# EAGLE design NSL_ESC (EAGLE 5.11)

## Sheet 1 of 3
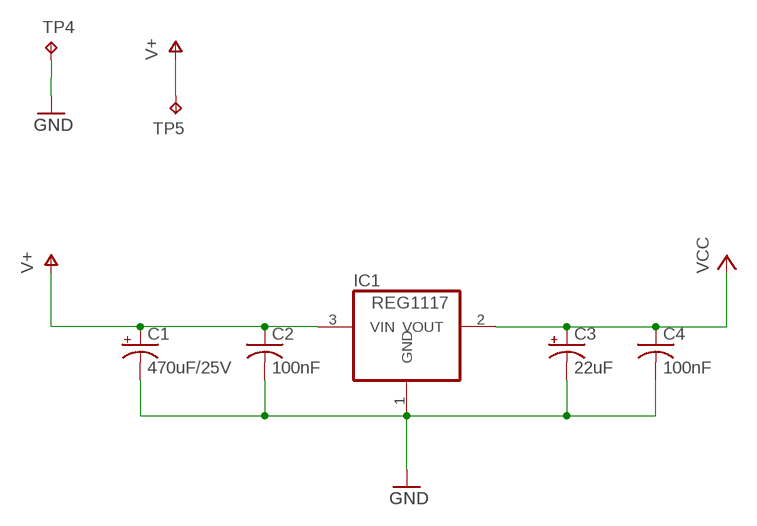
[diagram p0: schematic, sheet 1]

### Parts
C1  470uF/25V  CPOL-USE2-5  [E2-5]
C2  100nF  C-USC0805  [C0805]
C3  22uF  CPOL-USC/6032-28R  [C/6032-28R]
C4  100nF  C-USC0805  [C0805]
IC1  REG1117  [SOT223]
TP4  TPPAD1-20Y  [P1-20Y]
TP5  TPPAD1-20Y  [P1-20Y]

### Nets
GND: C1.- C2.2 C3.- C4.2 IC1.1(GND) TP4.TP ; also sheet 2,3
V+: C1.+ C2.1 IC1.3(VIN) TP5.TP ; also sheet 3
VCC: C3.+ C4.1 IC1.2(VOUT) ; also sheet 2

## Sheet 2 of 3
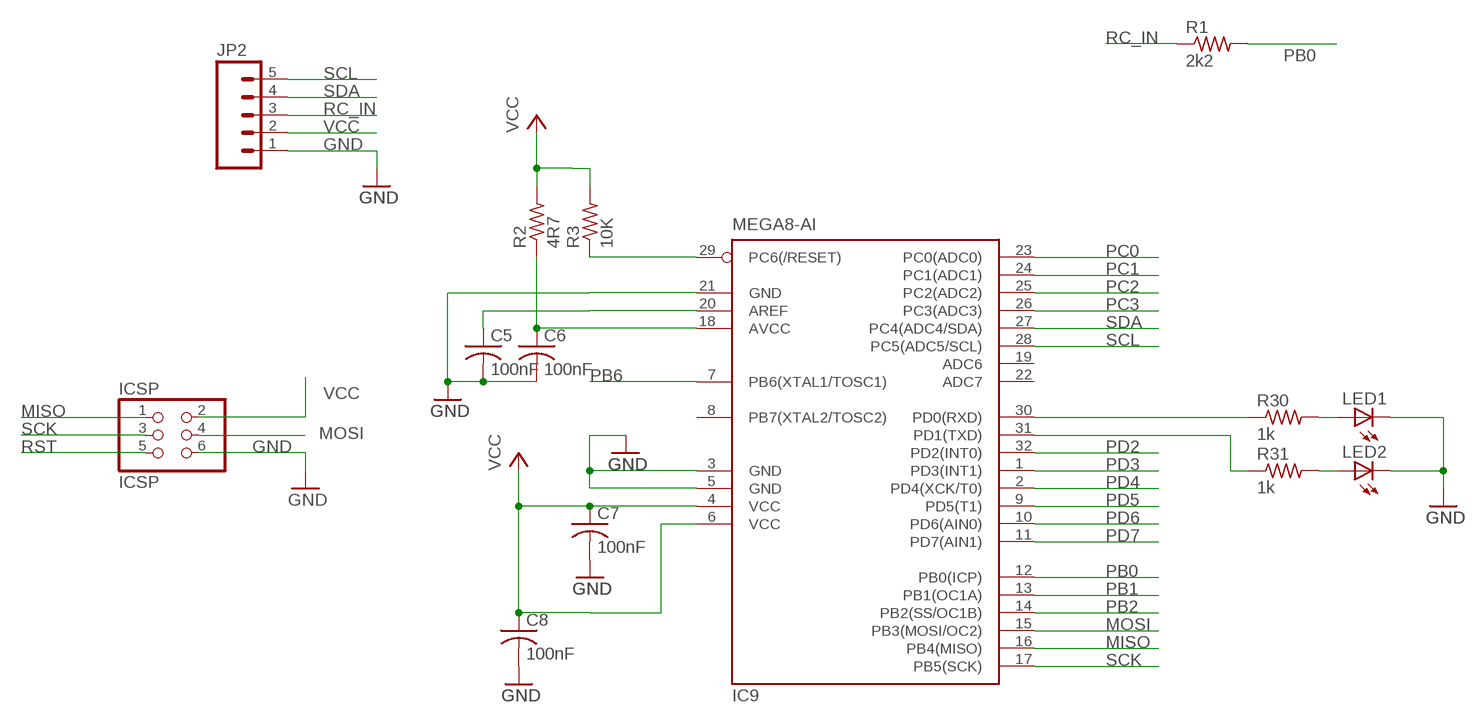
[diagram p1: schematic, sheet 2]

### Parts
C5  100nF  C-USC0805  [C0805]
C6  100nF  C-USC0805  [C0805]
C7  100nF  C-USC0805  [C0805]
C8  100nF  C-USC0805  [C0805]
IC9  MEGA8-AI  [TQFP32-08]
ICSP  ICSP  PINHD-2X3  [2X03]
JP2  M05PTH  [1X05]
LED1  LEDCHIP-LED0603  [CHIP-LED0603]
LED2  LEDCHIP-LED0603  [CHIP-LED0603]
R1  2k2  R-US_R0805  [R0805]
R2  4R7  R-US_R0805  [R0805]
R3  10K  R-US_R0805  [R0805]
R30  1k  R-US_R0805  [R0805]
R31  1k  R-US_R0805  [R0805]

### Nets
GND: C5.2 C6.2 C7.2 C8.2 IC9.3(GND) IC9.5(GND) IC9.21(GND) ICSP.6 JP2.1 LED1.C LED2.C ; also sheet 1,3
MISO: IC9.16(PB4(MISO)) ICSP.1
MOSI: IC9.15(PB3(MOSI/OC2)) ICSP.4
N$9: IC9.29(PC6(/RESET)) R3.1
N$13: IC9.30(PD0(RXD)) R30.1
N$17: C5.1 IC9.20(AREF)
N$19: C6.1 IC9.18(AVCC) R2.1
N$22: IC9.31(PD1(TXD)) R31.1
N$23: LED1.A R30.2
N$25: LED2.A R31.2
PB0: IC9.12(PB0(ICP)) R1.2
PB1: IC9.13(PB1(OC1A)) ; also sheet 3
PB2: IC9.14(PB2(SS/OC1B)) ; also sheet 3
PB6: IC9.7(PB6(XTAL1/TOSC1)) ; also sheet 3
PC0: IC9.23(PC0(ADC0)) ; also sheet 3
PC1: IC9.24(PC1(ADC1)) ; also sheet 3
PC2: IC9.25(PC2(ADC2)) ; also sheet 3
PC3: IC9.26(PC3(ADC3)) ; also sheet 3
PD2: IC9.32(PD2(INT0))
PD3: IC9.1(PD3(INT1)) ; also sheet 3
PD4: IC9.2(PD4(XCK/T0)) ; also sheet 3
PD5: IC9.9(PD5(T1)) ; also sheet 3
PD6: IC9.10(PD6(AIN0)) ; also sheet 3
PD7: IC9.11(PD7(AIN1))
RC_IN: JP2.3 R1.1
RST: ICSP.5
SCK: IC9.17(PB5(SCK)) ICSP.3
SCL: IC9.28(PC5(ADC5/SCL)) JP2.5
SDA: IC9.27(PC4(ADC4/SDA)) JP2.4
VCC: C7.1 C8.1 IC9.4(VCC) IC9.6(VCC) ICSP.2 JP2.2 R2.2 R3.2 ; also sheet 1
Unconnected: IC9.8(PB7(XTAL2/TOSC2)) IC9.19(ADC6) IC9.22(ADC7)

## Sheet 3 of 3
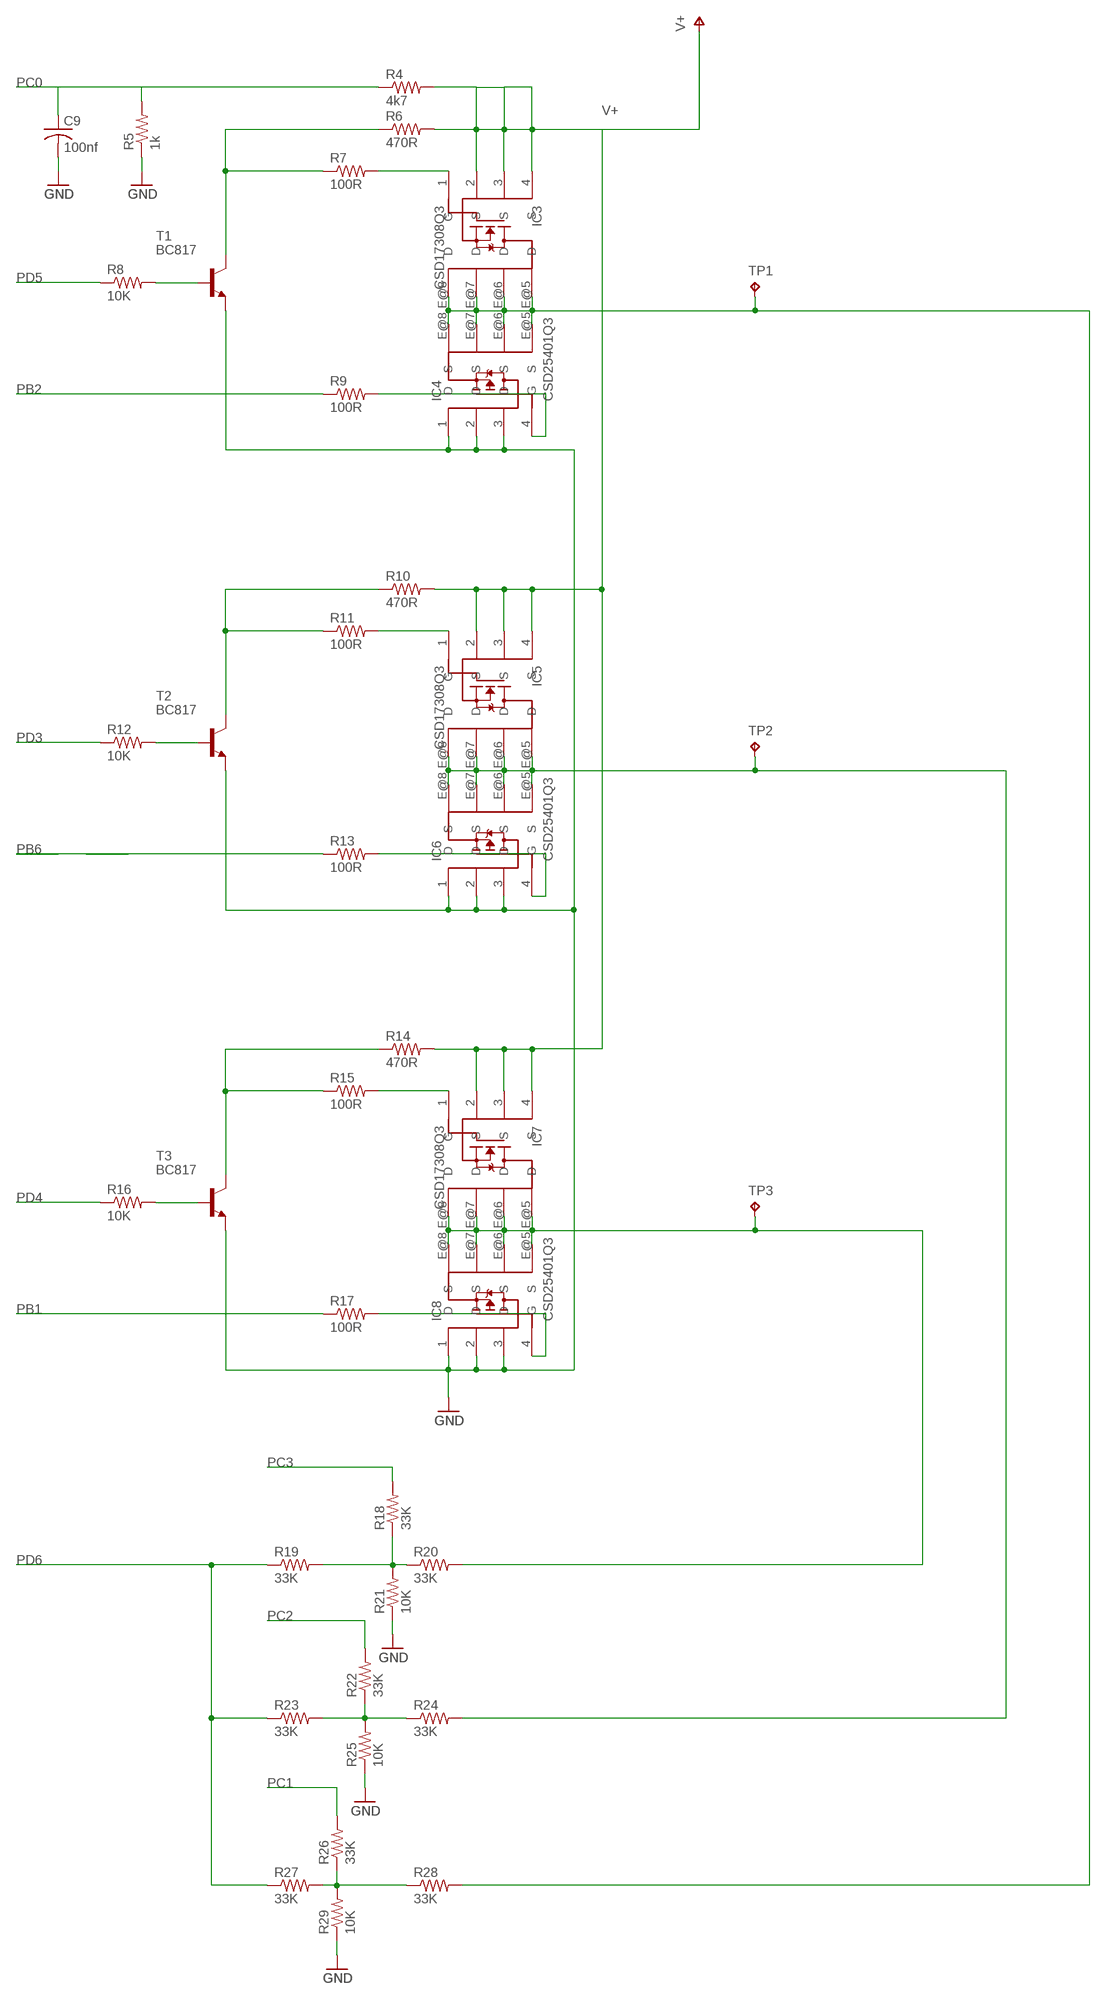
[diagram p2: schematic, sheet 3]

### Parts
C9  100nf  C-USC0805  [C0805]
IC3  CSD17308Q3  [SON-3.3X3.3]
IC4  CSD25401Q3  [SON-3.3X3.3]
IC5  CSD17308Q3  [SON-3.3X3.3]
IC6  CSD25401Q3  [SON-3.3X3.3]
IC7  CSD17308Q3  [SON-3.3X3.3]
IC8  CSD25401Q3  [SON-3.3X3.3]
R4  4k7  R-US_R0805  [R0805]
R5  1k  R-US_R0805  [R0805]
R6  470R  R-US_R0805  [R0805]
R7  100R  R-US_R0805  [R0805]
R8  10K  R-US_R0805  [R0805]
R9  100R  R-US_R0805  [R0805]
R10  470R  R-US_R0805  [R0805]
R11  100R  R-US_R0805  [R0805]
R12  10K  R-US_R0805  [R0805]
R13  100R  R-US_R0805  [R0805]
R14  470R  R-US_R0805  [R0805]
R15  100R  R-US_R0805  [R0805]
R16  10K  R-US_R0805  [R0805]
R17  100R  R-US_R0805  [R0805]
R18  33K  R-US_R0805  [R0805]
R19  33K  R-US_R0805  [R0805]
R20  33K  R-US_R0805  [R0805]
R21  10K  R-US_R0805  [R0805]
R22  33K  R-US_R0805  [R0805]
R23  33K  R-US_R0805  [R0805]
R24  33K  R-US_R0805  [R0805]
R25  10K  R-US_R0805  [R0805]
R26  33K  R-US_R0805  [R0805]
R27  33K  R-US_R0805  [R0805]
R28  33K  R-US_R0805  [R0805]
R29  10K  R-US_R0805  [R0805]
T1  BC817  BC817-16-NPN-SOT23-BEC  [SOT23-BEC]
T2  BC817  BC817-16-NPN-SOT23-BEC  [SOT23-BEC]
T3  BC817  BC817-16-NPN-SOT23-BEC  [SOT23-BEC]
TP1  TPPAD1-20Y  [P1-20Y]
TP2  TPPAD1-20Y  [P1-20Y]
TP3  TPPAD1-20Y  [P1-20Y]

### Nets
GND: C9.2 IC4.1(D) IC4.2(D) IC4.3(D) IC6.1(D) IC6.2(D) IC6.3(D) IC8.1(D) IC8.2(D) IC8.3(D) R5.1 R21.1 R25.1 R29.1 T1.E T2.E T3.E ; also sheet 1,2
MOTOR1: IC3.E@5(D) IC3.E@6(D) IC3.E@7(D) IC3.E@8(D) IC4.E@5(S) IC4.E@6(S) IC4.E@7(S) IC4.E@8(S) R28.2 TP1.TP
MOTOR2: IC5.E@5(D) IC5.E@6(D) IC5.E@7(D) IC5.E@8(D) IC6.E@5(S) IC6.E@6(S) IC6.E@7(S) IC6.E@8(S) R24.2 TP2.TP
MOTOR3: IC7.E@5(D) IC7.E@6(D) IC7.E@7(D) IC7.E@8(D) IC8.E@5(S) IC8.E@6(S) IC8.E@7(S) IC8.E@8(S) R20.2 TP3.TP
N$1: IC3.1(G) R7.2
N$2: R6.1 R7.1 T1.C
N$3: R18.1 R19.2 R20.1 R21.2
N$4: IC7.1(G) R15.2
N$5: R14.1 R15.1 T3.C
N$7: IC4.4(G) R9.2
N$8: R22.1 R23.2 R24.1 R25.2
N$10: R8.2 T1.B
N$11: IC5.1(G) R11.2
N$12: R10.1 R11.1 T2.C
N$15: IC6.4(G) R13.2
N$16: R26.1 R27.2 R28.1 R29.2
N$18: R12.2 T2.B
N$21: IC8.4(G) R17.2
N$24: R16.2 T3.B
PB1: R17.1 ; also sheet 2
PB2: R9.1 ; also sheet 2
PB6: R13.1 ; also sheet 2
PC0: C9.1 R4.1 R5.2 ; also sheet 2
PC1: R26.2 ; also sheet 2
PC2: R22.2 ; also sheet 2
PC3: R18.2 ; also sheet 2
PD3: R12.1 ; also sheet 2
PD4: R16.1 ; also sheet 2
PD5: R8.1 ; also sheet 2
PD6: R19.1 R23.1 R27.1 ; also sheet 2
V+: IC3.2(S) IC3.3(S) IC3.4(S) IC5.2(S) IC5.3(S) IC5.4(S) IC7.2(S) IC7.3(S) IC7.4(S) R4.2 R6.2 R10.2 R14.2 ; also sheet 1

## Library data of the parts
C1 C3 = rcl:CPOL-US: POLARIZED CAPACITOR, American symbol
C2 C4-C9 = rcl:C-US: CAPACITOR, American symbol
IC1 = burr-brown:REG1117: 800mA and 1A Low Dropout (LDO) Positive Regulator 1.8V, 2.5V, 2.85V, 3.3V, 5V, and Adj; MPN: REG1117; OC_FARNELL: 1097566; OC_NEWARK: 14P6981
IC3 IC5 IC7 = NSL_ESC:CSD17308Q3
IC4 IC6 IC8 = NSL_ESC:CSD25401Q3
IC9 = atmel:MEGA8: MICROCONTROLLER 8 Kbytes FLASH, 1 kbytes SRAM, 512 bytes EEPROM, USART, 6-channel 10 bit ADC, 2-channel 8 bit ADC Pin compatible with Atmega48, ATMega88, ATMega168 Source: avr.lbr; MPN: ATMEGA8-16AU; OC_FARNELL: 9171371; OC_NEWARK: 73M8863
ICSP = pinhead:PINHD-2X3: PIN HEADER
JP2 = SparkFun:M05: Header 5 Standard 5-pin 0.1" header. Use with straight break away headers (SKU : PRT-00116), right angle break away headers (PRT-00553), swiss pins (PRT-00743), machine pins (PRT-00117), and female headers (PRT-00115). Molex polarized connector foot print use with SKU : PRT-08230 with associated crimp pins and housings.
LED1 LED2 = led:LED: LED OSRAM: - CHIPLED LG R971, LG N971, LY N971, LG Q971, LY Q971, LO R971, LY R971 LH N974, LH R974 LS Q976, LO Q976, LY Q976 LO Q996 - Hyper CHIPLED LW Q18S LB Q993, LB Q99A, LB R99A - SideLED LS A670, LO A670, LY A670, LG A670, LP A670 LB A673, LV A673, LT A673, LW A673 LH A674 LY A675 LS A676, LA A676, LO A676, LY A676, LW A676 LS A679, LY A679, LG A679 - Hyper Micro SIDELED® LS Y876, LA Y876, LO Y876, LY Y876 LT Y87S - SmartLED LW L88C, LW L88S LB L89C, LB L89S, LG L890 LS L89K, LO L89K, LY L89K LS L896, LA L896, LO L896, LY L896 - TOPLED LS T670, LO T670, LY T670, LG T670, LP T670 LSG T670, LSP T670, LSY T670, LOP T670, LYG T670 LG T671, LOG T671, LSG T671 LB T673, LV T673, LT T673, LW T673 LH T674 LS T676, LA T676, LO T676, LY T676, LB T676, LH T676, LSB T676, LW T676 LB T67C, LV T67C, LT T67C, LS T67K, LO T67K, LY T67K, LW E67C LS E67B, LA E67B, LO E67B, LY E67B, LB E67C, LV E67C, LT E67C LW T67C LS T679, LY T679, LG T679 LS T770, LO T770, LY T770, LG T770, LP T770 LB T773, LV T773, LT T773, LW T773 LH T774 LS E675, LA E675, LY E675, LS T675 LS T776, LA T776, LO T776, LY T776, LB T776 LHGB T686 LT T68C, LB T68C - Hyper Mini TOPLED® LB M676 - Mini TOPLED Santana® LG M470 LS M47K, LO M47K, LY M47K Source: http://www.osram.convergy.de LUXEON: - LUMILED® LXK2-PW12-R00, LXK2-PW12-S00, LXK2-PW14-U00, LXK2-PW14-V00 LXK2-PM12-R00, LXK2-PM12-S00, LXK2-PM14-U00 LXK2-PE12-Q00, LXK2-PE12-R00, LXK2-PE12-S00, LXK2-PE14-T00, LXK2-PE14-U00 LXK2-PB12-K00, LXK2-PB12-L00, LXK2-PB12-M00, LXK2-PB14-N00, LXK2-PB14-P00, LXK2-PB14-Q00 LXK2-PR12-L00, LXK2-PR12-M00, LXK2-PR14-Q00, LXK2-PR14-R00 LXK2-PD12-Q00, LXK2-PD12-R00, LXK2-PD12-S00 LXK2-PH12-R00, LXK2-PH12-S00 LXK2-PL12-P00, LXK2-PL12-Q00, LXK2-PL12-R00 Source: www.luxeon.com KINGBRIGHT: KA-3528ASYC Source: www.kingbright.com
R1-R31 = rcl:R-US_: RESISTOR, American symbol
T1-T3 = transistor:*-NPN-: NPN Transistror BF959 corrected 2008.03.06
TP1-TP5 = testpad:TP: Test pad

## Net classes
1 power: width 0.203 mm

## Board
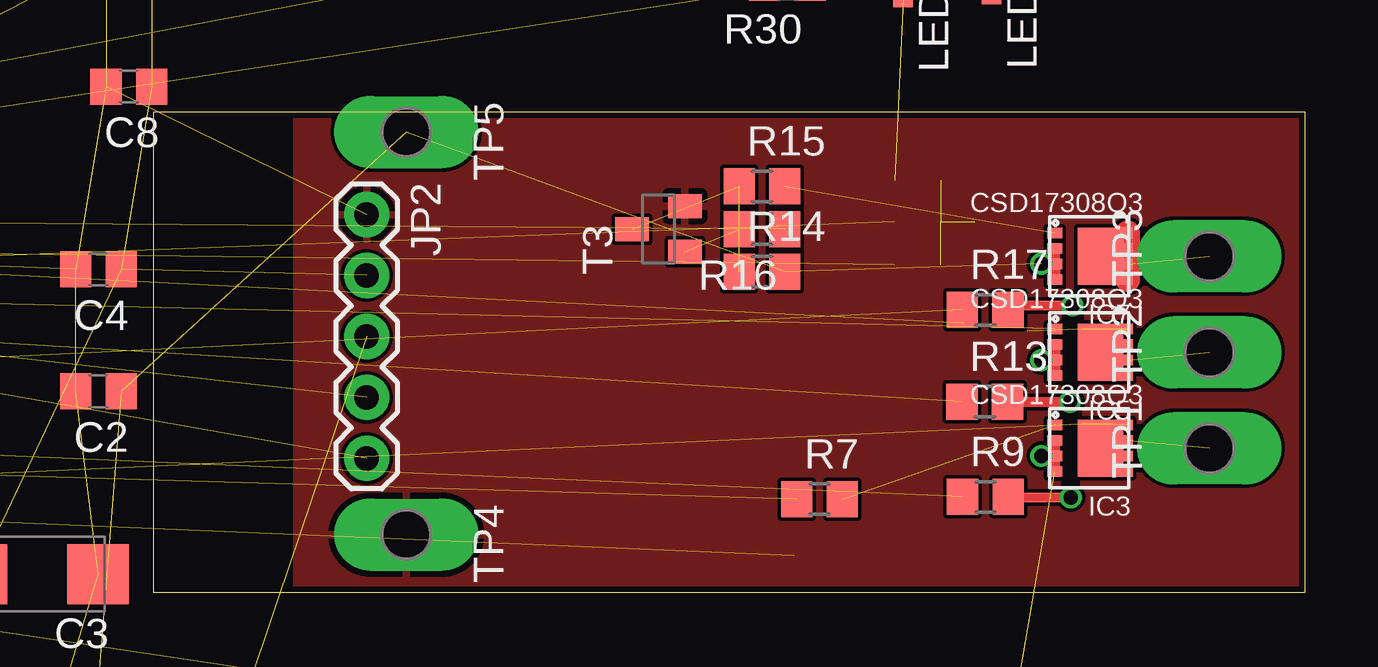
[diagram p3: board, top side]
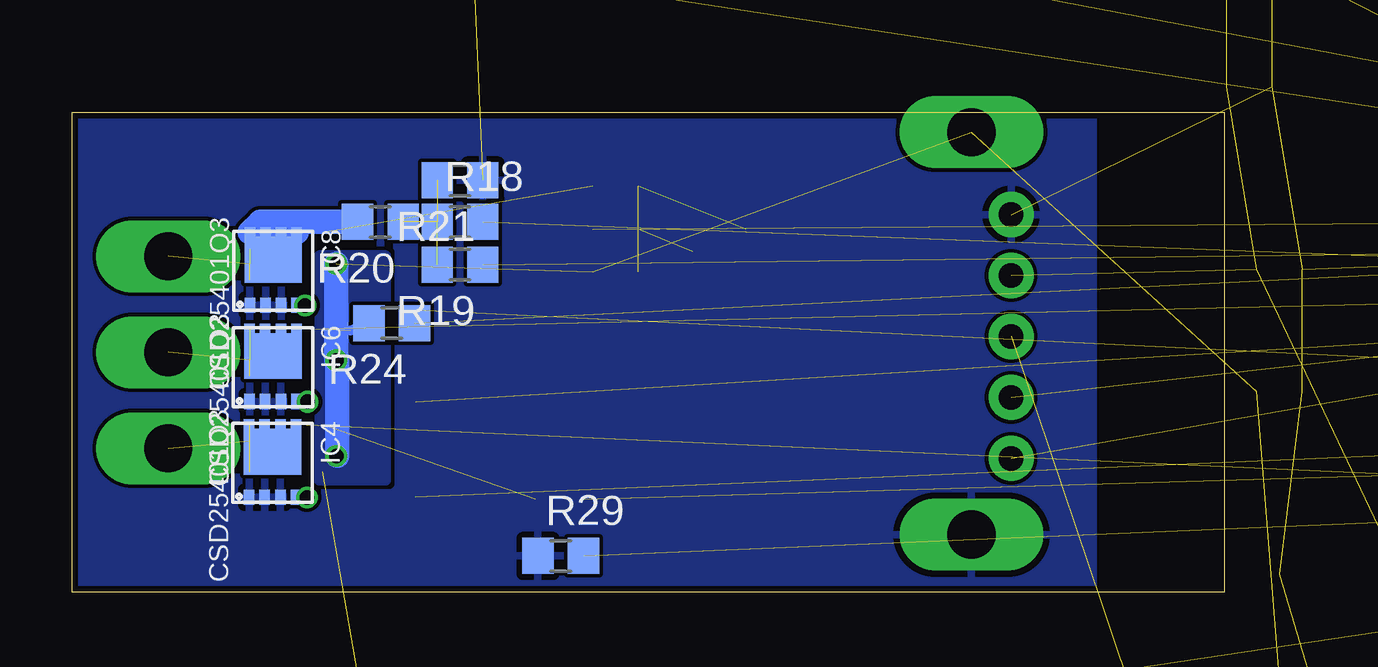
[diagram p4: board, bottom side, seen from below]

Size 48 x 20 mm. Coordinates in mm from the lower left corner, seen from the top.
Outline: 48,20 0,20 0,0 48,0 48,20
Copper layers (1*16): Top 0.035mm / dielectric 1.5mm / Bottom 0.035mm
Design rules "ITead_rule": minimum track width 6mil, minimum drill 12mil, track to track 6mil, track to pad 6mil, pad to pad 6mil, via to via 6mil, smd to smd 0mil, copper to edge 10mil, drill to drill 10mil, minimum pad ring 10mil, minimum via ring 6mil, stop-mask expansion 2mil, vias tented up to drill 100mil, thermal gap 10mil

### Footprints (pad centres in the part's own frame; a part is rotated, then mirrored left to right if it is on the bottom)
E2-5 = drill 0.813 pad 1.27 round: + -1.016,0 | drill 0.813 pad 1.27 octagon: - 1.016,0
C0805 = smd 1.3 x 1.5: 1 -0.95,0; 2 0.95,0
C/6032-28R = smd 2.55 x 2.5: + 2.525,0; - -2.525,0
SOT223 = smd 1.499 x 2.007: 1 -2.261,-3.15; 2 0.025,-3.15; 3 2.311,-3.15 | smd 3.81 x 2.007: 4 0,3.15
SON-3.3X3.3 = smd 0.63 x 0.44: 1 1.435,-0.975; 2 1.435,-0.325; 3 1.435,0.325; 4 1.435,0.975 | smd 1.9 x 2.39: E -0.46,0 | smd 0.41 x 0.44: E@5 -1.6,-0.975; E@6 -1.6,-0.325; E@7 -1.6,0.325; E@8 -1.6,0.975
TQFP32-08 = smd 1.27 x 0.559: 1 -4.293,2.8; 2 -4.293,2; 3 -4.293,1.2; 4 -4.293,0.4; 5 -4.293,-0.4; 6 -4.293,-1.2; 7 -4.293,-2; 8 -4.293,-2.8; 17 4.293,-2.8; 18 4.293,-2; 19 4.293,-1.2; 20 4.293,-0.4; 21 4.293,0.4; 22 4.293,1.2; 23 4.293,2; 24 4.293,2.8 | smd 0.559 x 1.27: 9 -2.8,-4.293; 10 -2,-4.293; 11 -1.2,-4.293; 12 -0.4,-4.293; 13 0.4,-4.293; 14 1.2,-4.293; 15 2,-4.293; 16 2.8,-4.293; 25 2.8,4.293; 26 2,4.293; 27 1.2,4.293; 28 0.4,4.293; 29 -0.4,4.293; 30 -1.2,4.293; 31 -2,4.293; 32 -2.8,4.293
2X03 = drill 1.016 octagon: 1 -2.54,-1.27; 2 -2.54,1.27; 3 0,-1.27; 4 0,1.27; 5 2.54,-1.27; 6 2.54,1.27
1X05 = drill 1.016 pad 1.88 round: 1 0,0; 2 2.54,0; 3 5.08,0; 4 7.62,0; 5 10.16,0
CHIP-LED0603 = smd 0.8 x 0.8: A 0,-0.75; C 0,0.75
R0805 = smd 1.3 x 1.5: 1 -0.95,0; 2 0.95,0
SOT23-BEC = smd 1 x 1.4: B -0.95,-1.1; C 0,1.1; E 0.95,-1.1
P1-20Y = drill 2.007 pad 2.54 long: TP 0,0

### Placement (x,y rotation side)
C1  -3.56,-6.87 180 top  (outside the outline)
C2  -2.29,8.37 180 top
C3  -4.83,0.75 180 top
C4  -2.29,13.45 180 top
C5  -1.02,33.77 180 top  (outside the outline)
C6  11.68,40.12 180 top  (outside the outline)
C7  -1.02,27.42 180 top  (outside the outline)
C8  -1.02,21.07 180 top
C9  -38.05,3.75 90 top  (outside the outline)
IC1  -47.32,17.47 0 bottom  (outside the outline)
IC3  39,6 180 top
IC4  39.66,5.4 270 bottom
IC5  39,10 180 top
IC6  39.64,9.38 270 bottom
IC7  39,14 180 top
IC8  39.63,13.4 270 bottom
IC9  -42.08,11.21 315 top  (outside the outline)
ICSP  -48.47,4.77 180 top  (outside the outline)
JP2  8.89,15.74 270 top
LED1  31.24,25.52 180 top  (outside the outline)
LED2  34.92,25.65 180 top  (outside the outline)
R1  -2.29,-19.57 180 top  (outside the outline)
R2  11.68,33.77 180 top  (outside the outline)
R3  5.33,33.77 180 top  (outside the outline)
R4  34.44,-7.6 0 top  (outside the outline)
R5  -36.15,3.75 270 top  (outside the outline)
R6  -29.72,5.58 0 top  (outside the outline)
R7  27.76,3.88 0 top
R8  -37.04,6.67 0 top  (outside the outline)
R9  34.67,3.98 0 top
R10  -13.74,-8.11 0 top  (outside the outline)
R11  -29.04,12.51 0 top  (outside the outline)
R12  -35,14.17 0 top  (outside the outline)
R13  34.64,7.94 0 top
R14  25.36,13.36 0 top
R15  25.36,16.91 0 top
R16  25.36,15.14 180 top
R17  34.66,11.77 0 top
R18  31.85,15.44 0 bottom
R19  31.85,13.66 180 bottom
R20  35.17,15.43 180 bottom
R21  31.85,17.16 180 bottom
R22  -32.97,14.42 0 bottom  (outside the outline)
R23  -32.97,14.42 0 top  (outside the outline)
R24  34.69,11.22 180 bottom
R25  -29.04,14.42 0 bottom  (outside the outline)
R26  -33.38,2.76 0 bottom  (outside the outline)
R27  -33.35,4.64 0 top  (outside the outline)
R28  -29.77,3.93 0 top  (outside the outline)
R29  27.65,1.52 0 bottom
R30  26.41,25.39 180 top  (outside the outline)
R31  26.54,28.57 180 top  (outside the outline)
T1  -33.4,7.49 270 top  (outside the outline)
T2  -32.97,11.63 270 top  (outside the outline)
T3  21.05,15.14 90 top
TP1  44,6 90 top
TP2  44,10 90 top
TP3  44,14 90 top
TP4  10.54,2.41 270 top
TP5  10.54,19.17 270 top

### Tracks (layer width: path | path; a pad name or v marks a point on that pad's centre or on a via)
GND  (20 unrouted)
  pour Top (rank 6): 51.18,-1.02 5.97,-1.02 5.97,21.84 51.18,21.84
  pour Bottom (rank 6): 51.81,-1.79 5.46,-1.79 5.46,22.6 51.81,22.6
MISO  (1 unrouted)
MOSI  (1 unrouted)
MOTOR1  (9 unrouted)
MOTOR2  (9 unrouted)
  Bottom 0.406: R24.2 36.41,10.91
MOTOR3  (4 unrouted)
  Top 1.016: IC7.E@5 IC7.E@8
  Bottom 1.016: R20.2 40.17,15.43 40.22,15.38 | 40.22,15.38 IC8.E@5 | IC8.E@7 IC8.E@6 39.95,15.11 40.22,15.38 | IC8.E@7 IC8.E@8 IC8.E@7
N$1  (1 unrouted)
N$2  (2 unrouted)
N$3  (3 unrouted)
N$4  (1 unrouted)
N$5  (2 unrouted)
N$7  (via drill 0.6)
  Top 0.406: v38.22,3.96 35.64,3.96 R9.2
  Bottom 0.406: IC4.4 38.23,3.96 v38.22,3.96
N$8  (3 unrouted)
N$9  (1 unrouted)
N$10  (1 unrouted)
N$11  (1 unrouted)
N$12  (2 unrouted)
N$13  (1 unrouted)
N$15  (via drill 0.6)
  Top 0.406: R13.2 v38.2,7.94
  Bottom 0.406: IC6.4 v38.2,7.95 v38.2,7.94
N$16  (3 unrouted)
N$17  (1 unrouted)
N$18  (1 unrouted)
N$19  (2 unrouted)
N$21  (via drill 0.6)
  Top 0.406: v38.3,11.96 35.79,11.96 R17.2
  Bottom 0.406: IC8.4 v38.3,11.96
N$22  (1 unrouted)
N$23  (1 unrouted)
N$24  (1 unrouted)
N$25  (1 unrouted)
PB0  (1 unrouted)
PB1  (1 unrouted)
PB2  (1 unrouted)
PB6  (1 unrouted)
PC0  (3 unrouted)
PC1  (1 unrouted)
PC2  (1 unrouted)
PC3  (1 unrouted)
PD3  (1 unrouted)
PD4  (1 unrouted)
PD5  (1 unrouted)
PD6  (3 unrouted)
RC_IN  (1 unrouted)
SCK  (1 unrouted)
SCL  (1 unrouted)
SDA  (1 unrouted)
V+  (via drill 0.6)  (8 unrouted)
  Top 0.254: IC3.2 37.56,5.71 37.54,5.68 36.95,5.68
  Top 0.356: IC3.3 36.99,5.67 v37,5.68 | v37,9.66 IC5.3 | IC7.3 37.05,13.68 v37,13.69
  Top 0.457: IC3.4 IC3.3 IC3.2 | IC5.3 IC5.4 | IC5.3 37.55,10.31 IC5.2 37.56,9.72 37.54,9.7 37,9.7 | IC7.4 IC7.3 IC7.2
  Bottom 0.356: 36.98,9.66 v37,9.66 37.04,9.7
  Bottom 1.016: v37,13.69 v37,9.66 36.95,9.62 36.95,5.68
  pour Bottom: 37.49,4.67 34.92,4.67 34.92,14.04 37.46,14.04 37.72,14.04 37.72,4.67
VCC  (10 unrouted)